# EAGLE design Board4 (EAGLE 7.5.0)
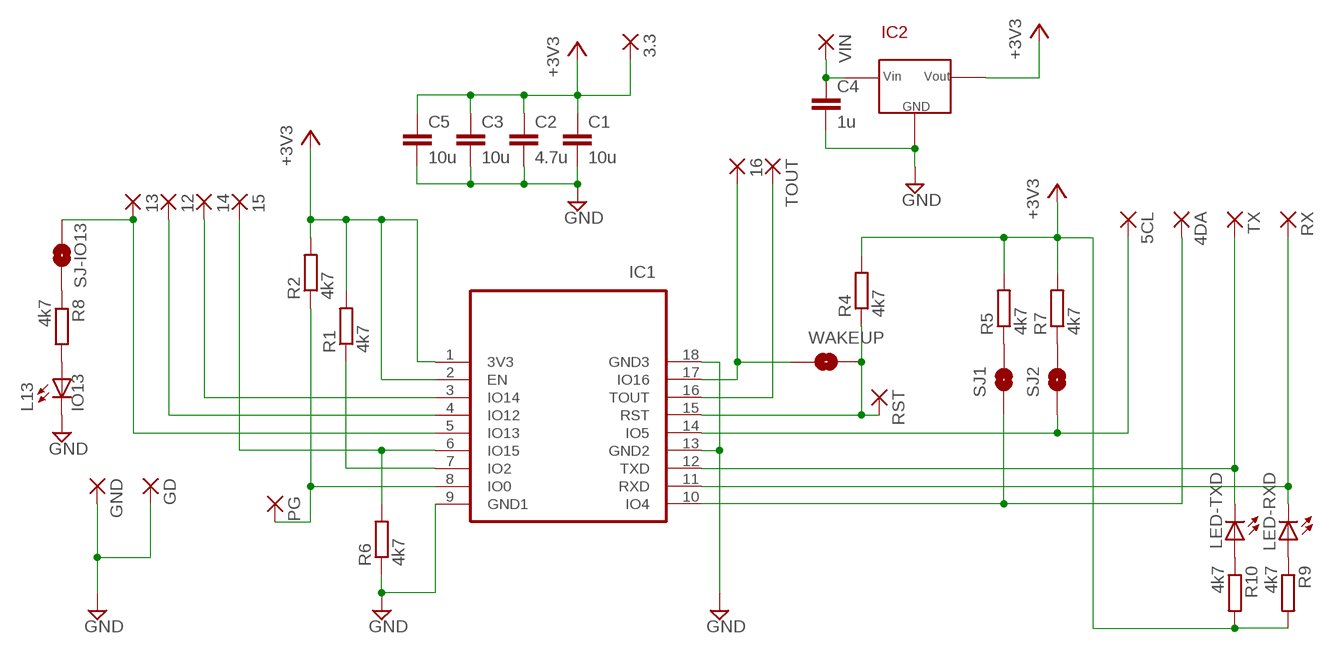
[diagram p0: schematic, sheet 1]

## Parts
3.3  1,6/0,9  [1,6/0,9]
4DA  1,6/0,9  [1,6/0,9]
5CL  1,6/0,9  [1,6/0,9]
12  1,6/0,9  [1,6/0,9]
13  1,6/0,9  [1,6/0,9]
14  1,6/0,9  [1,6/0,9]
15  1,6/0,9  [1,6/0,9]
16  1,6/0,9  [1,6/0,9]
C1  10u  C-EUC0805  [C0805]
C2  4.7u  C-EUC0805  [C0805]
C3  10u  C-EUC0805  [C0805]
C4  1u  C-EUC0603  [C0603]
C5  10u  C-EUC0805  [C0805]
GD  1,6/0,9  [1,6/0,9]
GND  1,6/0,9  [1,6/0,9]
IC1  ESP-WROOM-02FRONT-FACE  [FRONT-FACE]
IC2  NJM2845DL1  [TO-252-3]
L13  IO13  LEDCHIP-LED0603  [CHIP-LED0603]
LED-RXD  R  LEDCHIP-LED0603  [CHIP-LED0603]
LED-TXD  T  LEDCHIP-LED0603  [CHIP-LED0603]
PG  1,6/0,9  [1,6/0,9]
R1  4k7  R-EU_R0603  [R0603]
R2  4k7  R-EU_R0603  [R0603]
R4  4k7  R-EU_R0603  [R0603]
R5  4k7  R-EU_R0603  [R0603]
R6  4k7  R-EU_R0603  [R0603]
R7  4k7  R-EU_R0603  [R0603]
R8  4k7  R-EU_R0603  [R0603]
R9  4k7  R-EU_R0603  [R0603]
R10  4k7  R-EU_R0603  [R0603]
RST  1,6/0,9  [1,6/0,9]
RX  1,6/0,9  [1,6/0,9]
SJ1  SDA/PU  SOLDERJUMPERNO  [SJ_2S-NO]
SJ2  SCL/PU  SOLDERJUMPERNO  [SJ_2S-NO]
SJ-IO13  SOLDERJUMPERNO  [SJ_2S-NO]
TOUT  1,6/0,9  [1,6/0,9]
TX  1,6/0,9  [1,6/0,9]
VIN  1,6/0,9  [1,6/0,9]
WAKEUP  SOLDERJUMPERNO  [SJ_2S-NO]

## Nets
+3V3 [3V3]: 3.3.1(P) C1.1 C2.1 C3.1 C5.1 IC1.1(3V3) IC1.2(EN) IC2.VOUT R1.2 R2.2 R4.2 R5.2 R7.2 R9.2 R10.2
GND [GND]: C1.2 C2.2 C3.2 C4.2 C5.2 GD.1(P) GND.1(P) IC1.9(GND1) IC1.13(GND2) IC1.18(GND3) IC2.GND L13.C R6.1
N$1 [Vin]: C4.1 IC2.VIN VIN.1(P)
N$2: IC1.8(IO0) PG.1(P) R2.1
N$3: IC1.7(IO2) R1.1
N$4: 4DA.1(P) IC1.10(IO4) SJ1.1
N$5: IC1.11(RXD) LED-RXD.C RX.1(P)
N$6: IC1.12(TXD) LED-TXD.C TX.1(P)
N$7: 5CL.1(P) IC1.14(IO5) SJ2.1
N$8: IC1.15(RST) R4.1 RST.1(P) WAKEUP.2
N$9: IC1.16(TOUT) TOUT.1(P)
N$10: 16.1(P) IC1.17(IO16) WAKEUP.1
N$11: R5.1 SJ1.2
N$12: R7.1 SJ2.2
N$13: 14.1(P) IC1.3(IO14)
N$14: 15.1(P) IC1.6(IO15) R6.2
N$15: 12.1(P) IC1.4(IO12)
N$16: 13.1(P) IC1.5(IO13) SJ-IO13.1
N$17: R8.1 SJ-IO13.2
N$18: L13.A R8.2
N$22: LED-TXD.A R10.1
N$24: LED-RXD.A R9.1

## Library data of the parts
3.3 4DA 5CL 12-16 GD GND PG RST RX TOUT TX VIN = wirepad:1,6/0,9: THROUGH-HOLE PAD
C1-C5 = resistor:C-EU: CAPACITOR, European symbol
IC1 = esp-wroom-02:ESP-WROOM-02: WiFi module - ESP-WROOM-02
IC2 = NJM2845DL1:NJM2845DL1: New JRC NJM2845DL1 LDO Three-terminal regulator.
L13 LED-RXD LED-TXD = adafruit:LED: LED OSRAM: - CHIPLED LG R971, LG N971, LY N971, LG Q971, LY Q971, LO R971, LY R971 LH N974, LH R974 LS Q976, LO Q976, LY Q976 LO Q996 - Hyper CHIPLED LW Q18S LB Q993, LB Q99A, LB R99A - SideLED LS A670, LO A670, LY A670, LG A670, LP A670 LB A673, LV A673, LT A673, LW A673 LH A674 LY A675 LS A676, LA A676, LO A676, LY A676, LW A676 LS A679, LY A679, LG A679 - Hyper Micro SIDELED® LS Y876, LA Y876, LO Y876, LY Y876 LT Y87S - SmartLED LW L88C, LW L88S LB L89C, LB L89S, LG L890 LS L89K, LO L89K, LY L89K LS L896, LA L896, LO L896, LY L896 - TOPLED LS T670, LO T670, LY T670, LG T670, LP T670 LSG T670, LSP T670, LSY T670, LOP T670, LYG T670 LG T671, LOG T671, LSG T671 LB T673, LV T673, LT T673, LW T673 LH T674 LS T676, LA T676, LO T676, LY T676, LB T676, LH T676, LSB T676, LW T676 LB T67C, LV T67C, LT T67C, LS T67K, LO T67K, LY T67K, LW E67C LS E67B, LA E67B, LO E67B, LY E67B, LB E67C, LV E67C, LT E67C LW T67C LS T679, LY T679, LG T679 LS T770, LO T770, LY T770, LG T770, LP T770 LB T773, LV T773, LT T773, LW T773 LH T774 LS E675, LA E675, LY E675, LS T675 LS T776, LA T776, LO T776, LY T776, LB T776 LHGB T686 LT T68C, LB T68C - Hyper Mini TOPLED® LB M676 - Mini TOPLED Santana® LG M470 LS M47K, LO M47K, LY M47K Source: http://www.osram.convergy.de/
R1 R2 R4-R10 = resistor:R-EU_: RESISTOR, European symbol
SJ1 SJ2 SJ-IO13 WAKEUP = SparkFun:SOLDERJUMPER: Solder Jumper Standard SMD solder jumper. Used to automate production. Two varients : Normally Open and Normally Closed are the same, but have different paste layers. NC will have a large amount of paste and should jumper during reflow.

## Net classes
1 GND: width 0.61 mm
2 3V3: width 0.61 mm
3 Vin: width 0.61 mm

## Board
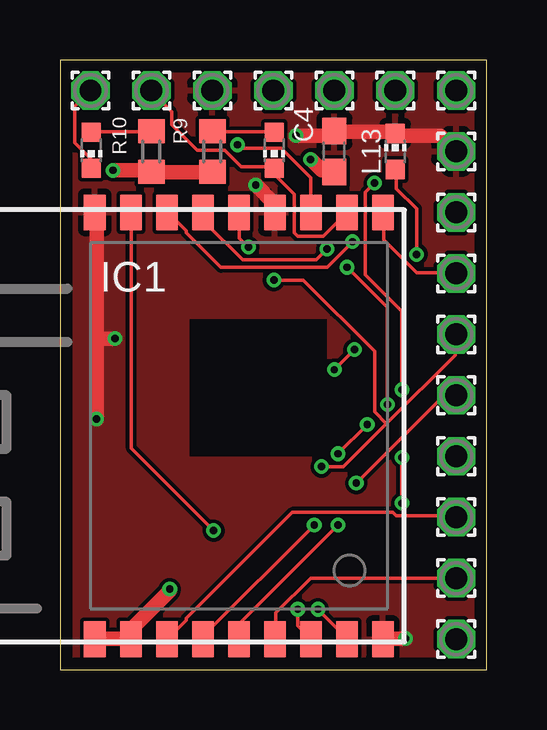
[diagram p1: board, top side]
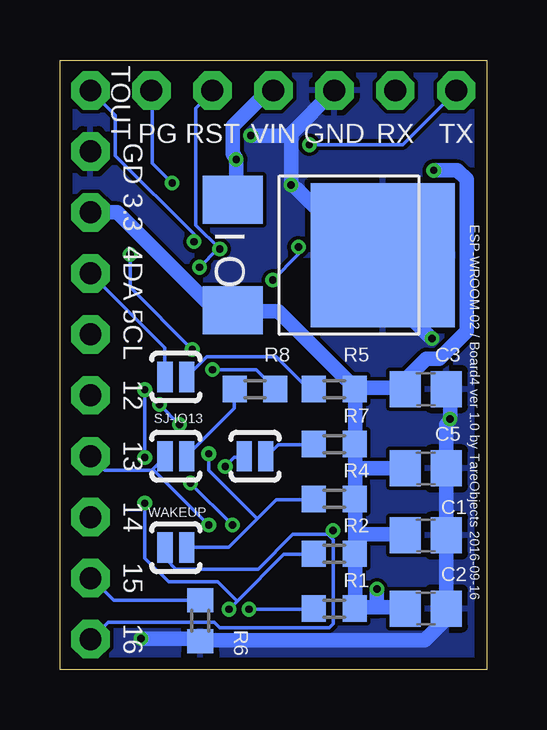
[diagram p2: board, bottom side, seen from below]

Size 17.78 x 25.4 mm. Coordinates in mm from the lower left corner, seen from the top.
Outline: 0,0 17.78,0 17.78,25.4 0,25.4 0,0
Copper layers (1*16): Top 0.035mm / dielectric 1.6mm / Bottom 0.035mm
Design rules "Elecrow_2-layer_PCB_eagle_rule": minimum track width 6mil, minimum drill 12mil, track to track 6mil, track to pad 6mil, pad to pad 6mil, via to via 8mil, smd to smd 0mil, copper to edge 20mil, drill to drill 10mil, minimum pad ring 6mil, minimum via ring 6mil, stop-mask expansion 0mil, vias tented up to drill 100mil, thermal gap 10mil

### Footprints (pad centres in the part's own frame; a part is rotated, then mirrored left to right if it is on the bottom)
1,6/0,9 = drill 0.914 pad 1.6 octagon: 1 0,0
C0805 = smd 1.3 x 1.5: 1 -0.85,0; 2 0.85,0
C0603 = smd 1.1 x 1: 1 -0.85,0; 2 0.85,0
FRONT-FACE = smd 1.485 x 0.9: 1 -8.893,4.9; 2 -8.893,3.4; 3 -8.893,1.9; 4 -8.893,0.4; 5 -8.893,-1.1; 6 -8.893,-2.6; 7 -8.893,-4.1; 8 -8.893,-5.6; 9 -8.893,-7.1; 10 8.893,-7.1; 11 8.893,-5.6; 12 8.893,-4.1; 13 8.893,-2.6; 14 8.893,-1.1; 15 8.893,0.4; 16 8.893,1.9; 17 8.893,3.4; 18 8.893,4.9
TO-252-3 = smd 6 x 6: GND 0,1.5 | smd 2 x 2.5: VIN -2.3,-4.75; VOUT 2.3,-4.75
CHIP-LED0603 = smd 0.8 x 0.8: A 0,-0.75; C 0,0.75
R0603 = smd 1 x 1.1: 1 -0.85,0; 2 0.85,0
SJ_2S-NO = smd 0.635 x 1.27: 1 -0.45,0; 2 0.45,0

### Placement (x,y rotation side)
3.3  16.51,19.05 270 top
4DA  16.51,16.51 90 top
5CL  16.51,13.97 270 top
12  16.51,11.43 90 top
13  16.51,8.89 90 top
14  16.51,6.35 90 top
15  16.51,3.81 270 top
16  16.51,1.27 90 top
C1  2.54,5.59 0 bottom
C2  2.54,2.54 0 bottom
C3  2.54,11.68 0 bottom
C4  11.43,21.59 90 top
C5  2.54,8.38 0 bottom
GD  16.51,21.59 270 top
GND  6.35,24.13 0 top
IC1  6.35,10.16 90 top
IC2  5.84,17.27 270 bottom
L13  13.97,21.59 0 top
LED-RXD  8.92,21.64 180 top
LED-TXD  1.3,21.64 180 top
PG  13.97,24.13 0 top
R1  6.35,2.54 0 bottom
R2  6.35,4.83 0 bottom
R4  6.35,7.11 0 bottom
R5  6.35,11.68 0 bottom
R6  11.94,2.03 90 bottom
R7  6.35,9.4 0 bottom
R8  9.65,11.68 0 bottom
R9  6.35,21.59 270 top
R10  3.81,21.59 270 top
RST  11.43,24.13 0 top
RX  3.81,24.13 90 top
SJ1  12.95,12.19 0 bottom
SJ2  9.65,8.89 0 bottom
SJ-IO13  12.95,8.89 0 bottom
TOUT  16.51,24.13 90 top
TX  1.27,24.13 90 top
VIN  8.89,24.13 180 top
WAKEUP  12.95,5.08 0 bottom

### Tracks (layer width: path | path; a pad name or v marks a point on that pad's centre or on a via)
+3V3  (via drill 0.3)
  Top 0.61: IC1.1 1.52,1.29 2.9,1.29 IC1.2 2.9,1.6 4.57,3.28 v4.57,3.35 | R9.2 6.33,20.73 3.81,20.73 R10.2 3.58,20.8 v2.21,20.8
  Bottom 0.61: 4.57,2.59 3.43,2.59 C2.1 | 4.57,2.59 5.49,2.59 R1.2 5.49,2.9 5.49,4.8 R2.2 5.49,5.11 5.49,5.64 | 5.49,5.64 5.49,7.09 R4.2 5.49,7.39 5.49,8.38 | 5.49,8.38 5.49,9.37 R7.2 5.49,9.68 5.49,11.66 R5.2 | 5.49,5.64 3.43,5.64 C1.1 | 5.49,8.38 C5.1 | R5.2 5.18,11.73 3.43,11.73 C3.1 3.43,12.04 2.52,12.95 1.98,12.95 0.84,14.1 0.84,20.42 1.22,20.8 v2.21,20.8 | 4.57,2.59 v4.57,3.35 | R5.2 5.64,11.89 8.69,14.94 10.59,14.94 IC2.VOUT 10.9,15.09 11.43,15.09 15.39,19.05 3.3.1
GND  (via drill 0.3)
  Top 0.61: GD.1 15.85,22.25 14.25,22.25 L13.C 13.95,22.4 11.43,22.4 C4.2 11.2,22.25 v9.83,22.25 | v8.15,20.19 8.91,19.43 8.91,19.13 IC1.13 | v14.4,1.29 13.49,1.29 IC1.9 | v1.52,10.44 1.52,13.79 | 1.52,13.79 1.52,19.05 IC1.18 | 1.52,13.79 v2.29,13.79
  Bottom 0.61: 8.15,22.25 8.15,22.33 GND.1 | 8.15,22.25 v8.15,20.19 7.92,20.04 5.18,17.3 4.34,17.3 IC2.GND 4.19,16.99 4.19,15.7 v2.29,13.79 | 8.15,22.25 v9.83,22.25 | v14.4,1.29 12.19,1.29 R6.1 11.89,1.22 2.59,1.22 1.75,2.06 1.75,2.52 C2.2 1.68,2.82 1.68,5.33 C1.2 1.68,5.64 1.68,8.38 C5.2 1.68,8.61 1.68,10.21 v1.52,10.44 1.52,11.51 1.68,11.66 C3.2
  pour Bottom: 0,0 19.05,0 19.05,25.4 0,25.4
  pour Top: 0,0 20.32,0 20.32,25.4 0,25.4
N$1  (via drill 0.3)
  Top 0.61: v10.44,21.26 10.9,20.8 11.43,20.8 C4.1
  Bottom 0.61: IC2.VIN 10.59,19.58 10.44,19.74 v10.44,21.26 10.59,21.49 10.59,22.63 9.14,24.08 8.91,24.08 VIN.1
N$2  (via drill 0.3)
  Top 0.152: v10.74,2.52 11.96,1.29 IC1.8 | v13.11,20.27 12.72,19.89 12.72,16.46 14.25,14.94 v14.25,11.66 | v14.25,6.93 v14.25,8.84
  Bottom 0.152: v10.74,2.52 10.4,2.86 | 10.4,2.86 8.46,4.8 7.24,4.8 R2.1 | v13.11,20.27 13.95,21.11 13.95,24.08 PG.1 | v14.25,8.84 v14.25,11.66 | v14.25,6.93 14.25,4.65 13.26,3.66 11.2,3.66 10.4,2.86
N$3  (via drill 0.3)
  Top 0.152: v9.91,2.52 9.91,1.83 10.44,1.29 IC1.7
  Bottom 0.152: v9.91,2.52 7.24,2.52 R1.1
N$4
  Top 0.152: IC1.10 13.49,19.05 13.49,17.91 14.86,16.54 16.46,16.54 4DA.1
  Bottom 0.152: 4DA.1 13.41,13.41 SJ1.1
N$5
  Top 0.152: IC1.11 11.96,19.05 10.97,18.06 9.91,18.06 9.75,18.21 9.75,19.81 8.99,20.57 8.99,20.88 LED-RXD.C 8.91,20.95 7.54,20.95 6.86,21.64 5.71,21.64 4.65,22.71 4.65,23.24 3.81,24.08 RX.1
N$6  (via drill 0.3)
  Top 0.152: TX.1 0.61,23.47 0.61,21.95 1.29,21.26 1.29,20.95 LED-TXD.C | v7.39,21.87 7.54,21.72 9.22,21.72 10.44,20.5 10.44,19.13 IC1.12
  Bottom 0.152: v7.39,21.87 3.5,21.87 1.29,24.08 TX.1
N$7  (via drill 0.3)
  Top 0.152: v10.9,8.46 11.81,8.46 13.6,10.25 | 13.6,10.25 16.46,13.11 16.46,13.95 5CL.1 | v7.85,17.6 7.47,17.98 7.47,19.05 IC1.14 | v8.91,16.23 10.13,16.23 13.11,13.26 13.11,10.74 13.6,10.25
  Bottom 0.152: v10.9,8.46 10.52,8.84 10.13,8.84 SJ2.1 | v7.85,17.6 7.85,17.3 v8.91,16.23
N$8  (via drill 0.3)
  Top 0.152: v11.12,17.53 10.67,17.07 7.62,17.07 6.02,18.67 6.02,19.05 IC1.15 | v12.8,10.21 v11.58,8.99 | v13.64,11.05 13.64,15.09 v11.96,16.76
  Bottom 0.152: 9.56,6.29 10.74,5.11 12.5,5.11 WAKEUP.2 | 9.56,6.29 8.76,7.09 7.24,7.09 R4.1 | RST.1 11.43,24.08 12.12,23.39 12.12,18.52 v11.12,17.53 11.2,17.53 v11.96,16.76 | 9.56,6.29 11.58,8.31 v11.58,8.99 | v13.64,11.05 v12.8,10.21
N$9  (via drill 0.3)
  Top 0.152: v12.19,17.83 11.12,16.76 6.71,16.76 5.26,18.21 5.26,18.29 4.5,19.05 IC1.16
  Bottom 0.152: v12.19,17.83 12.19,18.14 15.47,21.41 15.47,23.09 TOUT.1
N$10  (via drill 0.3)
  Top 0.152: v6.4,5.79 2.97,9.22 2.97,19.05 IC1.17
  Bottom 0.152: 6.59,5.6 6.4,5.41 6.4,1.91 6.55,1.75 11.12,1.75 11.35,1.98 15.77,1.98 16.46,1.29 16.1 | 6.59,5.6 6.63,5.64 8.08,5.64 9.53,4.19 12.95,4.19 13.34,4.57 13.34,5.03 WAKEUP.1 | 6.59,5.6 v6.4,5.79
N$11
  Bottom 0.152: R5.1 7.24,11.73 7.47,11.73 8.76,13.03 11.66,13.03 SJ1.2
N$12
  Bottom 0.152: R7.1 7.24,9.37 8.69,9.37 9.14,8.91 SJ2.2
N$13
  Top 0.152: IC1.3 4.5,1.29 5.26,2.06 5.26,2.13 9.68,6.55 13.87,6.55 14.02,6.4 16.46,6.4 14.1
N$14
  Top 0.152: 15.1 10.44,3.81 8.99,2.36 8.99,1.29 IC1.6
  Bottom 0.152: R6.2 11.96,2.9 15.54,2.9 16.46,3.81 15.1
N$15  (via drill 0.3)
  Top 0.152: v10.59,6.02 6.02,1.45 6.02,1.29 IC1.4 | v12.34,7.77 16,11.43 12.1
  Bottom 0.152: v12.34,7.77 v10.59,6.02
N$16  (via drill 0.3)
  Top 0.152: v11.58,6.02 7.47,1.91 7.47,1.29 IC1.5
  Bottom 0.152: 13.91,8.34 13.95,8.31 15.93,8.31 13.1 | 13.91,8.34 13.41,8.84 SJ-IO13.1 | 13.91,8.34 v11.58,6.02
N$17
  Bottom 0.152: R8.1 10.52,11.66 10.52,10.9 12.5,8.91 SJ-IO13.2
N$18  (via drill 0.3)
  Top 0.152: v14.86,17.3 14.86,19.2 14.02,20.04 14.02,20.8 L13.A | v11.43,12.5 v12.27,13.34
  Bottom 0.152: v14.86,17.3 14.86,15.93 v12.27,13.34 | v11.43,12.5 9.6,12.5 8.84,11.73 R8.2
N$22
  Top 0.152: LED-TXD.A 1.37,22.4 3.81,22.4 R10.1
N$24
  Top 0.152: LED-RXD.A 8.91,22.4 6.4,22.4 R9.1

### Text on the board
bNames: ESP-WROOM-02 / Board4 ver 1.0 by TareObjects 2016-09-16